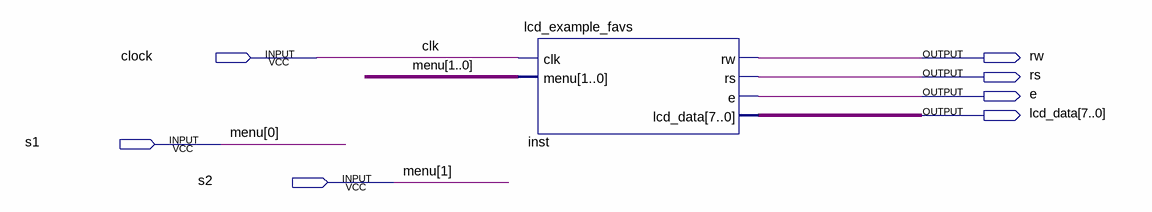
[diagram p0: schematic sheet]
// Quartus schematic lcdquarto.bdf as structural Verilog: 1 symbols, 7 pins
module lcdquarto (
  input  clock,
  input  s1,
  input  s2,
  output rw,
  output rs,
  output e,
  output [7:0] lcd_data
);

  lcd_example_favs inst (.clk(clock), .menu({s2, s1}), .rw(rw), .rs(rs), .e(e), .lcd_data(lcd_data));

  // Other names for the same wires on the sheet: clk = clock; menu[1:0] = {s2, s1}
endmodule
